# EAGLE design midi_pad_laser_optimized (EAGLE 9.6.2)
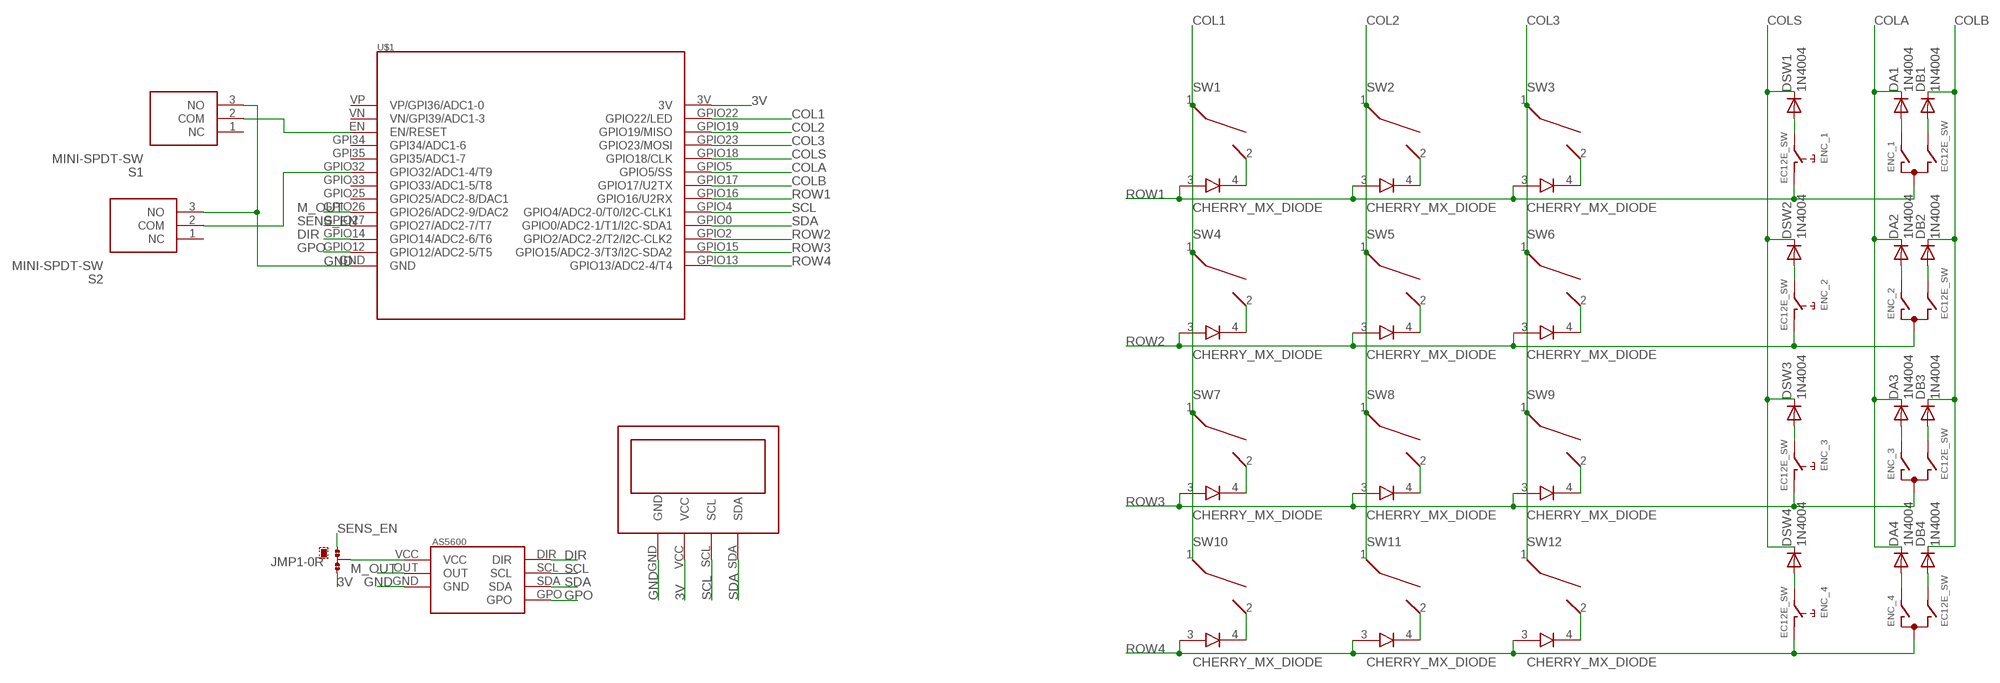
[diagram p0: schematic, sheet 1]

## Parts
DA1  1N4004  [DO41-10]
DA2  1N4004  [DO41-10]
DA3  1N4004  [DO41-10]
DA4  1N4004  [DO41-10]
DB1  1N4004  [DO41-10]
DB2  1N4004  [DO41-10]
DB3  1N4004  [DO41-10]
DB4  1N4004  [DO41-10]
DSW1  1N4004  [DO41-10]
DSW2  1N4004  [DO41-10]
DSW3  1N4004  [DO41-10]
DSW4  1N4004  [DO41-10]
ENC_1  EC12E_SW  [ALPS_EC12E_SW]
ENC_2  EC12E_SW  [ALPS_EC12E_SW]
ENC_3  EC12E_SW  [ALPS_EC12E_SW]
ENC_4  EC12E_SW  [ALPS_EC12E_SW]
JMP1  0R-JUMPA  [A0R-JMP]
S1  MINI-SPDT-SW  [MINISPDTSW]
S2  MINI-SPDT-SW  [MINISPDTSW]
SW1  CHERRY_MX_DIODE  [MX1A-XX[D/J]N]
SW2  CHERRY_MX_DIODE  [MX1A-XX[D/J]N]
SW3  CHERRY_MX_DIODE  [MX1A-XX[D/J]N]
SW4  CHERRY_MX_DIODE  [MX1A-XX[D/J]N]
SW5  CHERRY_MX_DIODE  [MX1A-XX[D/J]N]
SW6  CHERRY_MX_DIODE  [MX1A-XX[D/J]N]
SW7  CHERRY_MX_DIODE  [MX1A-XX[D/J]N]
SW8  CHERRY_MX_DIODE  [MX1A-XX[D/J]N]
SW9  CHERRY_MX_DIODE  [MX1A-XX[D/J]N]
SW10  CHERRY_MX_DIODE  [MX1A-XX[D/J]N]
SW11  CHERRY_MX_DIODE  [MX1A-XX[D/J]N]
SW12  CHERRY_MX_DIODE  [MX1A-XX[D/J]N]
U$1  LOLIN32_LITE  [LOLIN32_LITE]
U$2  AS5600_BREAKOUT  [AS5600_BREAKOUT]
U$3  I2C_OLED_128X64  [I2C_OLED_128X64_BREAKOUT]

## Nets
3V: JMP1.3 U$1.3V U$3.VCC
COL1: SW1.1 SW4.1 SW7.1 SW10.1 U$1.GPIO22(GPIO22/LED)
COL2: SW2.1 SW5.1 SW8.1 SW11.1 U$1.GPIO19(GPIO19/MISO)
COL3: SW3.1 SW6.1 SW9.1 SW12.1 U$1.GPIO23(GPIO23/MOSI)
COLA: DA1.C DA2.C DA3.C DA4.C U$1.GPIO5(GPIO5/SS)
COLB: DB1.C DB2.C DB3.C DB4.C U$1.GPIO17(GPIO17/U2TX)
COLS: DSW1.C DSW2.C DSW3.C DSW4.C U$1.GPIO18(GPIO18/CLK)
DIR: U$1.GPIO14(GPIO14/ADC2-6/T6) U$2.DIR
GND: S1.3(NO) S2.3(NO) U$1.GND U$2.GND U$3.GND
GPO: U$1.GPIO12(GPIO12/ADC2-5/T5) U$2.GPO
M_OUT: U$1.GPIO26(GPIO26/ADC2-9/DAC2) U$2.OUT
N$1: SW1.2 SW1.4
N$2: SW2.2 SW2.4
N$3: SW3.2 SW3.4
N$4: SW4.2 SW4.4
N$5: SW5.2 SW5.4
N$6: SW6.2 SW6.4
N$7: SW7.2 SW7.4
N$8: SW8.2 SW8.4
N$9: SW9.2 SW9.4
N$10: SW10.2 SW10.4
N$11: SW11.2 SW11.4
N$12: SW12.2 SW12.4
N$13: JMP1.2 U$2.VCC
N$14: S1.2(COM) U$1.EN(EN/RESET)
N$15: S2.2(COM) U$1.GPIO32(GPIO32/ADC1-4/T9)
N$20: DSW1.A ENC_1.E
N$21: DA1.A ENC_1.A
N$22: DB1.A ENC_1.B
N$23: DSW2.A ENC_2.E
N$24: DA2.A ENC_2.A
N$25: DB2.A ENC_2.B
N$26: DSW3.A ENC_3.E
N$27: DA3.A ENC_3.A
N$28: DB3.A ENC_3.B
N$29: DSW4.A ENC_4.E
N$30: DA4.A ENC_4.A
N$31: DB4.A ENC_4.B
ROW1: ENC_1.C ENC_1.D SW1.3 SW2.3 SW3.3 U$1.GPIO16(GPIO16/U2RX)
ROW2: ENC_2.C ENC_2.D SW4.3 SW5.3 SW6.3 U$1.GPIO2(GPIO2/ADC2-2/T2/I2C-CLK2)
ROW3: ENC_3.C ENC_3.D SW7.3 SW8.3 SW9.3 U$1.GPIO15(GPIO15/ADC2-3/T3/I2C-SDA2)
ROW4: ENC_4.C ENC_4.D SW10.3 SW11.3 SW12.3 U$1.GPIO13(GPIO13/ADC2-4/T4)
SCL: U$1.GPIO4(GPIO4/ADC2-0/T0/I2C-CLK1) U$2.SCL U$3.SCL
SDA: U$1.GPIO0(GPIO0/ADC2-1/T1/I2C-SDA1) U$2.SDA U$3.SDA
SENS_EN: JMP1.1 U$1.GPIO27(GPIO27/ADC2-7/T7)
Unconnected: ENC_1.GND1(G) ENC_1.GND2(G) ENC_2.GND1(G) ENC_2.GND2(G) ENC_3.GND1(G) ENC_3.GND2(G) ENC_4.GND1(G) ENC_4.GND2(G) S1.1(NC) S2.1(NC) U$1.GPI34(GPI34/ADC1-6) U$1.GPI35(GPI35/ADC1-7) U$1.GPIO25(GPIO25/ADC2-8/DAC1) U$1.GPIO33(GPIO33/ADC1-5/T8) U$1.VN(VN/GPI39/ADC1-3) U$1.VP(VP/GPI36/ADC1-0)

## Library data of the parts
DA1-DA4 DB1-DB4 DSW1-DSW4 = adafruit:1N4004: DIODE General purpose 1N400x type rectifier (With bigger pads) http://www.ladyada.net/library/pcb/eaglelibrary.html
ENC_1-ENC_4 = my-switch-alps:EC12E_SW: ALPS rotary Encoder EC12E series with switch; MPN: EC12E2424407; OC_FARNELL: 1520813; OC_NEWARK: 74M1068
JMP1 = jump-0r-smd:0R-JUMP: SMD 0R 0805 Jumper
S1 S2 = SamacSys_Parts:MINI-SPDT-SW: Slide Switches MINI SPDT SWITCH Source: Datasheet <http://site.gravitech.us/Components/MINI-SPDT-SW/EG1218_datasheet.pdf>; DESCRIPTION: Slide Switches MINI SPDT SWITCH; HEIGHT: mm; MANUFACTURER_NAME: Gravitech; MANUFACTURER_PART_NUMBER: MINI-SPDT-SW; MOUSER_PART_NUMBER: 992-MINI-SPDT-SW; MOUSER_PRICE-STOCK: https://www.mouser.co.uk/ProductDetail/Gravitech/MINI-SPDT-SW?qs=Vxac6xGyzPm8ENq695r3yA%3D%3D
SW1-SW12 = Cherry_MX_v7.0:CHERRY_MX_DIODE
U$1 = my_breakouts:LOLIN32_LITE
U$2 = my_breakouts:AS5600_BREAKOUT
U$3 = my_breakouts:I2C_OLED_128X64

## Board
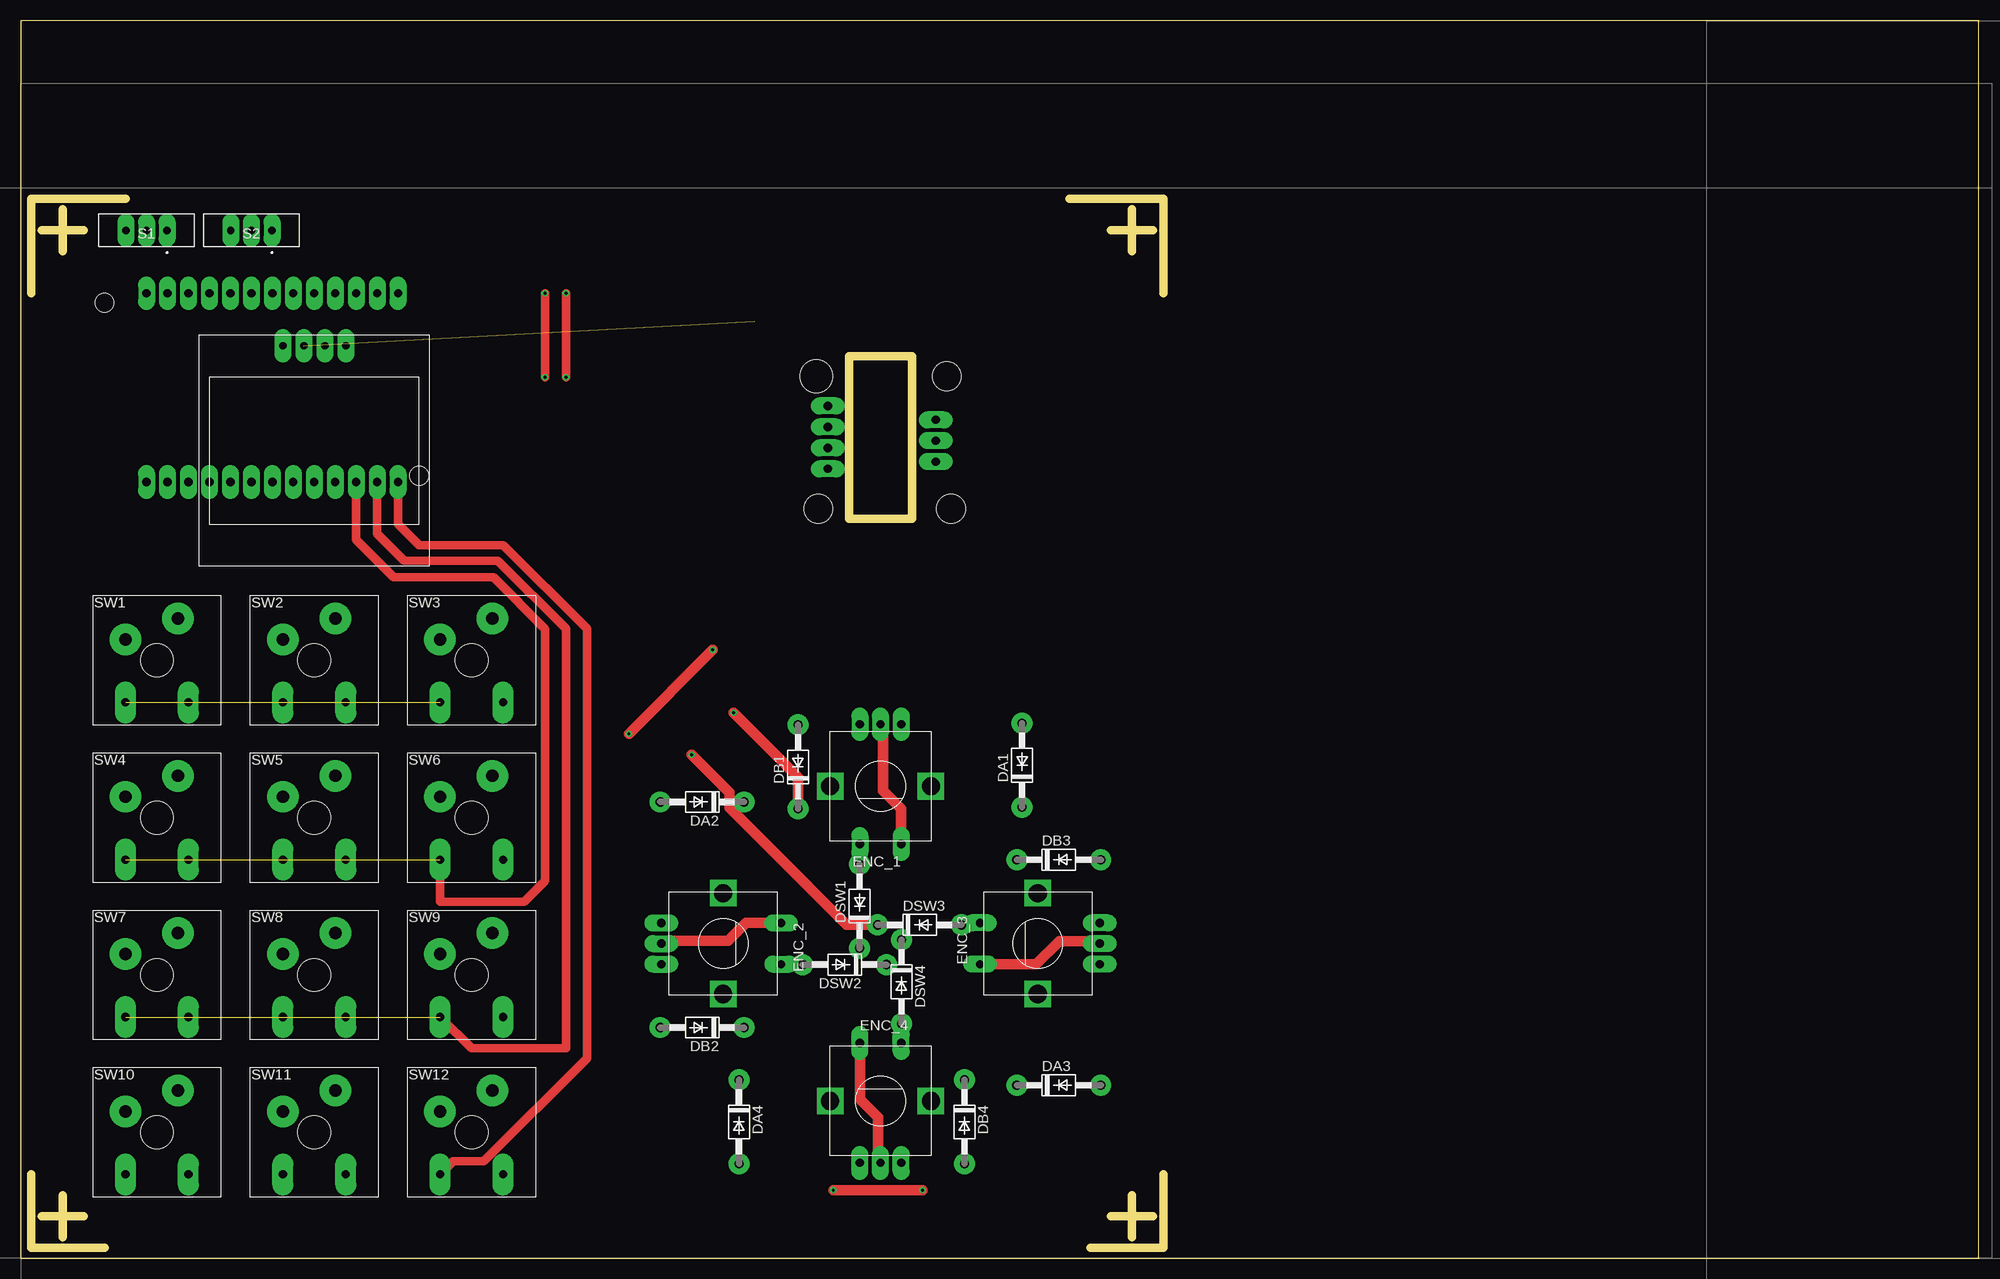
[diagram p1: board, top side]
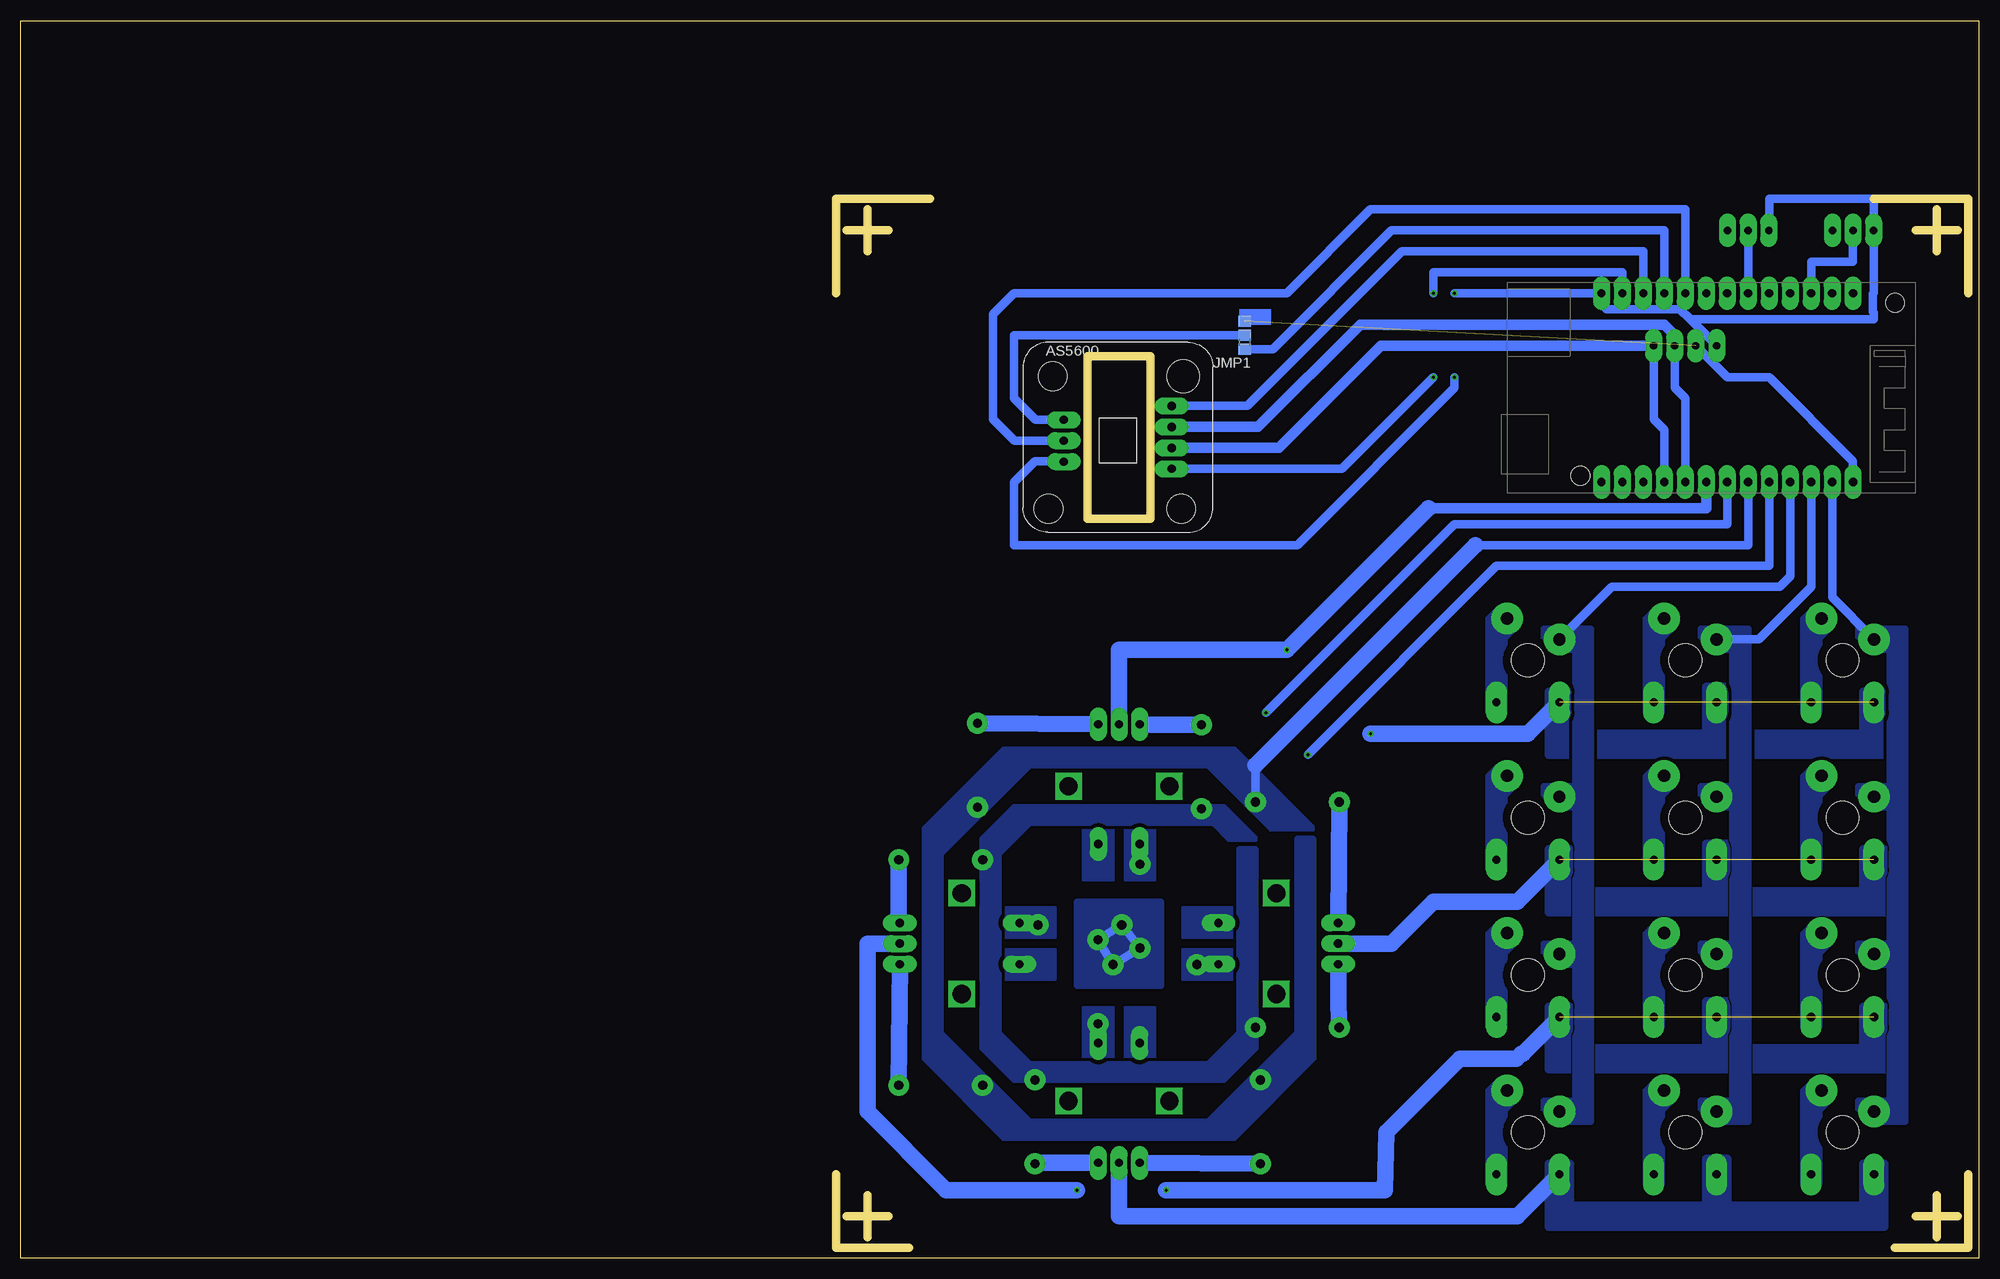
[diagram p2: board, bottom side, seen from below]

Size 237.16 x 149.85 mm. Coordinates in mm from the lower left corner, seen from the top.
Outline: 0,0 237.16,0 237.16,149.85 0,149.85 0,0
Copper layers (1*16): Top 0.035mm / dielectric 1.5mm / Bottom 0.035mm
Design rules "default *": minimum track width 6mil, minimum drill 0.35mm, track to track 6mil, track to pad 6mil, pad to pad 6mil, via to via 6mil, smd to smd 6mil, copper to edge 40mil, drill to drill 6mil, minimum pad ring 10mil, minimum via ring 8mil, stop-mask expansion 4mil, vias tented up to drill 0mil, thermal gap 10mil
Holes 0.35 mm at 134.62,124.46 5.08,5.08 134.62,5.08 5.08,124.46
Milling: 20 lines

### Footprints (pad centres in the part's own frame; a part is rotated, then mirrored left to right if it is on the bottom)
DO41-10 = drill 1.118 pad 2.54: A 5.08,0; C -5.08,0
ALPS_EC12E_SW = drill 1 pad 2.032 long: A -2.5,-7.5; B 2.5,-7.5; C 0,-7.5; D -2.5,7; E 2.5,7 | drill 2.2 square: GND1 -6.1,0; GND2 6.1,0
A0R-JMP = smd 1.5 x 1.3: 1 0,1.7; 2 0,0; 3 0,-1.7
MINISPDTSW = drill 0.9 pad 2.032 long: 1 -2.5,0; 2 0,0; 3 2.5,0
MX1A-XX[D/J]N = drill 1.5 pad 3.81: 1 -3.81,2.54; 2 2.54,5.08 | drill 1 pad 2.54 long: 3 -3.81,-5.08; 4 3.81,-5.08 | hole 4: 0,0
LOLIN32_LITE = drill 1 pad 2.032 long: 3V 10.16,15.24; EN -12.7,10.16; GND -12.7,-15.24; GPI34 -12.7,7.62; GPI35 -12.7,5.08; GPIO0 10.16,-7.62; GPIO2 10.16,-10.16; GPIO4 10.16,-5.08; GPIO5 10.16,2.54; GPIO12 -12.7,-12.7; GPIO13 10.16,-15.24; GPIO14 -12.7,-10.16; GPIO15 10.16,-12.7; GPIO16 10.16,-2.54; GPIO17 10.16,0; GPIO18 10.16,5.08; GPIO19 10.16,10.16; GPIO22 10.16,12.7; GPIO23 10.16,7.62; GPIO25 -12.7,-2.54; GPIO26 -12.7,-5.08; GPIO27 -12.7,-7.62; GPIO32 -12.7,2.54; GPIO33 -12.7,0; VN -12.7,12.7; VP -12.7,15.24 | hole 2.286: 9.398,-17.78; -11.557,20.32
AS5600_BREAKOUT = drill 1 pad 2.032 long: DIR 13.997,14.299; GND 0.922,7.546; GPO 13.997,6.679; OUT 0.922,10.086; SCL 13.997,11.759; SDA 13.997,9.219; VCC 0.922,12.626 | hole 3.5: -0.908,1.838; -0.4,17.892; 15.146,1.838 | hole 4: 15.4,17.892
I2C_OLED_128X64_BREAKOUT = drill 0.9 pad 2.032 long: GND -10.16,1.27; SCL -15.24,1.27; SDA -17.78,1.27; VCC -12.7,1.27

### Placement (x,y rotation side)
DA1  121.28,59.69 90 top
DA2  82.55,55.24 180 top
DA3  125.73,20.95 0 top
DA4  87,16.51 270 top
DB1  94.15,59.51 90 top
DB2  82.55,27.94 180 top
DB3  125.73,48.26 0 top
DB4  114.3,16.51 270 top
DSW1  101.6,42.64 90 top
DSW2  99.79,35.56 180 top
DSW3  108.88,40.36 0 top
DSW4  106.68,33.48 270 top
ENC_1  104.14,57.15 180 top
ENC_2  85.09,38.1 270 top
ENC_3  123.19,38.1 90 top
ENC_4  104.14,19.05 0 top
JMP1  88.9,111.76 180 bottom
S1  15.24,124.46 180 top
S2  27.94,124.46 180 top
SW1  16.51,72.39 0 top
SW2  35.56,72.39 0 top
SW3  54.61,72.39 0 top
SW4  16.51,53.34 0 top
SW5  35.56,53.34 0 top
SW6  54.61,53.34 0 top
SW7  16.51,34.29 0 top
SW8  35.56,34.29 0 top
SW9  54.61,34.29 0 top
SW10  16.51,15.24 0 top
SW11  35.56,15.24 0 top
SW12  54.61,15.24 0 top
U$1  30.48,104.14 270 bottom
U$2  111.76,88.9 0 bottom
U$3  21.59,111.76 180 top

### Tracks (layer width: path | path; a pad name or v marks a point on that pad's centre or on a via)
3V  (1 unrouted)
  Bottom 1.016: U$1.3V 15.24,96.52 25.4,106.68 30.48,106.68 U$3.VCC
COL1
  Bottom 1.016: SW1.1 17.78,80.01 U$1.GPIO22
  pour Bottom (isolate 0.533, no thermals): 8.89,16.51 14.61,16.51 14.61,19.05 10.79,19.05 10.79,35.56 14.61,35.56 14.61,38.1 10.79,38.1 10.79,54.61 14.61,54.61 14.61,57.15 10.79,57.15 10.79,73.66 14.61,73.66 14.61,76.2 8.89,76.2
COL2
  Bottom 1.016: U$1.GPIO19 20.32,81.28 26.67,74.93 SW2.1
  pour Bottom (isolate 0.533, no thermals): 27.94,16.51 33.66,16.51 33.66,19.05 29.84,19.05 29.84,35.56 33.66,35.56 33.66,38.1 29.84,38.1 29.84,54.61 33.66,54.61 33.66,57.15 29.84,57.15 29.84,73.66 33.66,73.66 33.66,76.2 27.94,76.2
COL3
  Bottom 1.016: U$1.GPIO23 22.86,82.55 24.13,81.28 44.45,81.28 SW3.1
  pour Bottom (isolate 0.533, no thermals): 46.99,16.51 52.7,16.51 52.7,19.05 48.9,19.05 48.9,35.56 52.7,35.56 52.7,38.1 48.9,38.1 48.9,54.61 52.7,54.61 52.7,57.15 48.9,57.15 48.9,73.66 52.7,73.66 52.7,76.2 46.99,76.2
COLA
  Bottom 1.016: U$1.GPIO5 27.94,86.36 60.96,86.36 | 87.63,59.69 DA2.C
  Bottom 2: 60.96,86.36 87.63,59.69
  pour Bottom (isolate 0.533, no thermals): 80.64,50.8 82.55,50.8 82.55,27.3 93.34,16.51 114.94,16.51 125.73,27.3 125.73,48.9 114.94,59.69 93.34,59.69 85.72,52.07 80.64,52.07 90.17,61.59 118.11,61.59 127.64,52.07 127.64,24.13 118.11,14.61 90.17,14.61 80.64,24.13
COLB  (via drill 0.35)
  Top 1.27: v86.36,66.04 94.15,58.25 DB1.C
  Bottom 1.016: U$1.GPIO17 30.48,88.9 63.5,88.9 v86.36,66.04
  pour Bottom (isolate 0.533, no thermals): 87.63,49.53 89.53,49.53 89.53,27.3 93.34,23.5 114.94,23.5 118.75,27.3 118.75,48.9 114.94,52.7 92.71,52.7 90.81,50.8 87.63,50.8 91.44,54.61 116.84,54.61 120.65,50.8 120.65,25.4 116.84,21.59 91.44,21.59 87.63,25.4
COLS  (via drill 0.35)
  Top 1.27: v81.28,60.96 85.88,56.36 85.88,54.52 100.04,40.36 DSW3.C
  Bottom 1.016: U$1.GPIO18 25.4,83.82 58.42,83.82 v81.28,60.96 | DSW1.C DSW2.C DSW4.C DSW3.C DSW1.C
  pour Bottom (isolate 0.533, no thermals): 99.06,43.18 99.06,33.02 109.22,33.02 109.22,43.18
DIR
  Bottom 1.016: U$1.GPIO14 40.64,121.92 69.85,121.92 88.57,103.2 U$2.DIR
GND  (via drill 0.35)
  Top 1.016: v63.5,116.84 v63.5,106.68
  Bottom 1.016: U$3.GND 34.92,113.67 | 34.92,113.67 36.2,114.94 45.09,114.94 45.72,115.57 U$1.GND v63.5,116.84 | 114.23,96.45 114.3,96.52 | v63.5,106.68 63.5,105.41 82.55,86.36 116.84,86.36 116.84,93.98 114.3,96.52 | 114.3,96.52 110.91,96.52 U$2.GND | 34.92,113.67 12.7,113.67 12.7,114.47 12.83,114.59 12.83,116.8 12.7,116.93 12.7,121.92 12.74,121.96 S1.3 12.7,124.5 12.7,128.27 25.4,128.27 25.4,124.5 S2.3
GPO  (via drill 0.35)
  Top 1.016: v66.04,116.84 v66.04,106.68
  Bottom 1.016: U$1.GPIO12 43.18,119.38 66.04,119.38 v66.04,116.84 | U$2.GPO 77.14,95.58 v66.04,106.68
M_OUT
  Bottom 1.016: U$1.GPIO26 35.56,127 73.66,127 83.82,116.84 116.84,116.84 119.38,114.3 119.38,101.6 116.77,98.99 U$2.OUT
N$1
  pour Bottom (isolate 0.152, rank 6, no thermals): 17.78,78.74 17.78,76.2 19.05,74.93 19.05,66.04 21.59,66.04 21.59,77.47 20.32,78.74
N$2
  pour Bottom (isolate 0.152, rank 6, no thermals): 36.83,78.74 36.83,76.2 38.1,74.93 38.1,66.04 40.64,66.04 40.64,77.47 39.37,78.74
N$3
  pour Bottom (isolate 0.152, rank 6, no thermals): 55.88,78.74 55.88,76.2 57.15,74.93 57.15,66.04 59.69,66.04 59.69,77.47 58.42,78.74
N$4
  pour Bottom (isolate 0.152, rank 6, no thermals): 17.78,59.69 17.78,57.15 19.05,55.88 19.05,46.99 21.59,46.99 21.59,58.42 20.32,59.69
N$5
  pour Bottom (isolate 0.152, rank 6, no thermals): 36.83,59.69 36.83,57.15 38.1,55.88 38.1,46.99 40.64,46.99 40.64,58.42 39.37,59.69
N$6
  pour Bottom (isolate 0.152, rank 6, no thermals): 55.88,59.69 55.88,57.15 57.15,55.88 57.15,46.99 59.69,46.99 59.69,58.42 58.42,59.69
N$7
  pour Bottom (isolate 0.152, rank 6, no thermals): 17.78,40.64 17.78,38.1 19.05,36.83 19.05,27.94 21.59,27.94 21.59,39.37 20.32,40.64
N$8
  pour Bottom (isolate 0.152, rank 6, no thermals): 36.83,40.64 36.83,38.1 38.1,36.83 38.1,27.94 40.64,27.94 40.64,39.37 39.37,40.64
N$9
  pour Bottom (isolate 0.152, rank 6, no thermals): 55.88,40.64 55.88,38.1 57.15,36.83 57.15,27.94 59.69,27.94 59.69,39.37 58.42,40.64
N$10
  pour Bottom (isolate 0.152, rank 6, no thermals): 17.78,21.59 17.78,19.05 19.05,17.78 19.05,8.89 21.59,8.89 21.59,20.32 20.32,21.59
N$11
  pour Bottom (isolate 0.152, rank 6, no thermals): 36.83,21.59 36.83,19.05 38.1,17.78 38.1,8.89 40.64,8.89 40.64,20.32 39.37,21.59
N$12
  pour Bottom (isolate 0.152, rank 6, no thermals): 55.88,21.59 55.88,19.05 57.15,17.78 57.15,8.89 59.69,8.89 59.69,20.32 58.42,21.59
N$13
  Bottom 1.016: JMP1.2 116.84,111.76 116.84,104.14 114.23,101.53 U$2.VCC
N$14
  Bottom 1.016: S1.2 15.24,120.65 20.32,120.65 U$1.EN
N$15
  Bottom 1.016: 27.94,123.19 S2.2 U$1.GPIO32
N$20
  Bottom 1.016: ENC_1.E DSW1.A
  pour Bottom (isolate 0.406, rank 2, no thermals): 99.69,45.72 103.5,45.72 103.5,52.07 99.69,52.07
N$21
  Bottom 2: ENC_1.A DA1.A
N$22
  Bottom 0.813: 101.59,64.6 ENC_1.B
  Bottom 2: DB1.A 101.59,64.6
N$23
  Bottom 1.016: ENC_2.E DSW2.A
  pour Bottom (isolate 0.406, rank 2, no thermals): 90.17,37.47 90.17,33.66 96.52,33.66 96.52,37.47
N$24
  Bottom 2: DA2.A ENC_2.A
N$25
  Bottom 2: ENC_2.B 77.59,30.6 DB2.A
N$26
  Bottom 1.016: DSW3.A ENC_3.E
  pour Bottom (isolate 0.406, rank 2, no thermals): 111.76,42.55 111.76,38.73 118.11,38.73 118.11,42.55
N$27
  Bottom 1.016: ENC_3.A
  Bottom 2: DA3.A ENC_3.A
N$28
  Bottom 0.813: 130.81,40.72 ENC_3.B
  Bottom 2: DB3.A 130.81,40.72
N$29
  Bottom 1.016: DSW4.A ENC_4.E
  pour Bottom (isolate 0.406, rank 2, no thermals): 104.78,24.13 108.58,24.13 108.58,30.48 104.78,30.48
N$30
  Bottom 1.016: ENC_4.A
  Bottom 2: ENC_4.A DA4.A
N$31
  Bottom 0.813: 113.68,11.55 DB4.A
  Bottom 2: ENC_4.B 113.68,11.55
ROW1  (via drill 0.35)  (2 unrouted)
  Top 1.27: v83.82,73.66 v73.66,63.5 | ENC_1.C 104.46,64.33 104.46,56.59 106.64,54.41 ENC_1.D
  Bottom 1.27: U$1.GPIO16 33.02,90.81 66.67,90.81
  Bottom 2: ENC_1.C 104.12,64.67 104.12,73.66 v83.82,73.66 66.67,90.81 | v73.66,63.5 54.61,63.5 SW3.3
  pour Bottom (isolate 0.406, rank 2, no thermals): 11.43,68.58 13.97,68.58 13.97,63.5 29.21,63.5 30.48,63.5 30.48,69.22 33.02,69.22 33.02,63.5 48.9,63.5 49.53,63.5 49.53,68.58 52.07,68.58 52.07,63.5 52.07,60.96 11.43,60.96
  pour Bottom (isolate 0.406, rank 2, no thermals): 104.78,45.72 108.58,45.72 108.58,52.07 104.78,52.07
ROW2  (2 unrouted)
  Top 1.016: U$1.GPIO2 40.64,87 45.2,82.43 57.26,82.43 63.5,76.19 63.5,45.72 60.96,43.18 50.8,43.18 SW6.3
  Top 1.27: ENC_2.C 77.91,38.42 85.66,38.42 87.83,40.6 ENC_2.D
  Bottom 2: SW6.3 55.88,43.18 66.04,43.18 71.12,38.1 ENC_2.C
  pour Bottom (isolate 0.152, rank 2, no thermals): 11.43,49.53 13.97,49.53 13.97,44.45 29.21,44.45 30.48,44.45 30.48,50.16 33.02,50.16 33.02,44.45 48.9,44.45 49.53,44.45 49.53,49.53 52.07,49.53 52.07,44.45 52.07,41.91 11.43,41.91
  pour Bottom (isolate 0.406, rank 2, no thermals): 96.52,38.73 96.52,42.55 90.17,42.55 90.17,38.73
ROW3  (via drill 0.35)  (2 unrouted)
  Top 1.016: SW9.3 54.61,25.4 66.04,25.4 66.04,76.2 57.78,84.45 46.45,84.45 43.18,87.73 U$1.GPIO15
  Top 1.27: v98.42,8.26 v109.22,8.26 | ENC_3.C 130.38,38.41 125.8,38.41 122.99,35.6 ENC_3.D
  Bottom 1.27: 55.24,24.77 55.4,24.77
  Bottom 2: SW9.3 55.24,24.77 | v98.42,8.26 71.92,8.26 71.75,15.24 62.86,24.14 56.04,24.14 55.4,24.77 | v109.22,8.26 125.09,8.26 134.62,17.78 134.62,38.1 ENC_3.C
  pour Bottom (isolate 0.152, rank 2, no thermals): 11.43,30.48 13.97,30.48 13.97,25.4 29.21,25.4 30.48,25.4 30.48,31.11 33.02,31.11 33.02,25.4 48.9,25.4 49.53,25.4 49.53,30.48 52.07,30.48 52.07,25.4 52.07,22.86 11.43,22.86
  pour Bottom (isolate 0.406, rank 2, no thermals): 118.11,33.66 118.11,37.47 111.76,37.47 111.76,33.66
ROW4
  Top 1.016: U$1.GPIO13 45.72,88.9 48.26,86.36 58.42,86.36 68.58,76.2 68.58,24.23 56.07,11.72 52.36,11.72 SW12.3
  Top 1.27: ENC_4.C 103.82,11.87 103.82,17.07 101.64,19.25 ENC_4.D
  Bottom 2: SW12.3 55.88,5.08 104.14,5.08 ENC_4.C
  pour Bottom (isolate 0.152, rank 2, no thermals): 11.43,11.43 13.97,11.43 13.97,6.35 29.21,6.35 30.48,6.35 30.48,12.06 33.02,12.06 33.02,6.35 48.9,6.35 49.53,6.35 49.53,11.43 52.07,11.43 52.07,6.35 52.07,3.81 11.43,3.81
  pour Bottom (isolate 0.406, rank 2, no thermals): 99.69,24.13 103.5,24.13 103.5,30.48 99.69,30.48
SCL
  Bottom 1.016: U$3.SCL 36.83,105.41 35.56,104.14 U$1.GPIO4
  Bottom 1.27: U$3.SCL 36.83,111.76 38.1,113.03 74.93,113.03 87.3,100.66 U$2.SCL
SDA
  Bottom 1.016: U$3.SDA 39.37,101.6 38.1,100.33 U$1.GPIO0
  Bottom 1.27: U$2.SDA 84.76,98.12 72.39,110.49 U$3.SDA
SENS_EN
  Bottom 1.016: U$1.GPIO27 38.1,124.46 71.12,124.46 85.52,110.06 JMP1.1
(copper drawn outside any net)
  shapes: Bottom area x1

### Text on the board
Milling: ████ | ████ | ████ | ████ | ████ | ████ | ████████████ | ████████████ | ████████████